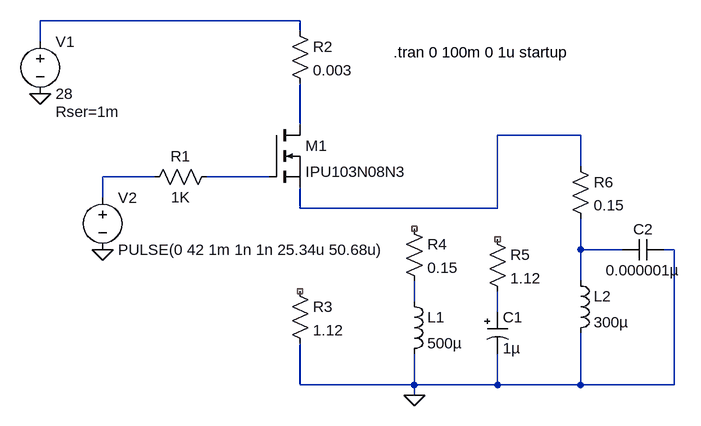
[diagram p0: schematic CurrentLim.asc]
CurrentLim.asc, the LTspice schematic file:
Version 4
SHEET 1 880 680
WIRE 192 -32 -208 -32
WIRE 192 -16 192 -32
WIRE -208 0 -208 -32
WIRE 192 128 192 64
WIRE 624 144 496 144
WIRE 624 192 624 144
WIRE -32 208 -112 208
WIRE 144 208 48 208
WIRE -112 240 -112 208
WIRE 192 256 192 224
WIRE 496 256 496 144
WIRE 496 256 192 256
WIRE 624 320 624 272
WIRE 688 320 624 320
WIRE 768 320 752 320
WIRE 624 368 624 320
WIRE 368 400 368 368
WIRE 496 416 496 384
WIRE 192 528 192 464
WIRE 368 528 368 480
WIRE 368 528 192 528
WIRE 496 528 496 480
WIRE 496 528 368 528
WIRE 624 528 624 448
WIRE 624 528 496 528
WIRE 768 528 768 320
WIRE 768 528 624 528
WIRE 368 544 368 528
FLAG -208 80 0
FLAG -112 320 0
FLAG 368 544 0
SYMBOL nmos 144 128 R0
SYMATTR InstName M1
SYMATTR Value IPU103N08N3
SYMBOL res -48 224 R270
WINDOW 0 32 56 VTop 2
WINDOW 3 0 56 VBottom 2
SYMATTR InstName R1
SYMATTR Value 1K
SYMATTR SpiceLine tol=1 pwr=0.1
SYMBOL res 176 -32 R0
SYMATTR InstName R2
SYMATTR Value 0.003
SYMATTR SpiceLine tol=1 pwr=2
SYMBOL res 176 368 R0
SYMATTR InstName R3
SYMATTR Value 1.12
SYMATTR SpiceLine tol=1 pwr=100
SYMBOL ind 352 384 R0
SYMATTR InstName L1
SYMATTR Value 500µ
SYMATTR SpiceLine Ipk=0.54 Rser=0.3225 Rpar=9420 Cpar=0
SYMBOL res 352 272 R0
SYMATTR InstName R4
SYMATTR Value 0.15
SYMATTR SpiceLine tol=1 pwr=100
SYMBOL polcap 480 416 R0
WINDOW 3 24 56 Left 2
SYMATTR InstName C1
SYMATTR Value 1µ
SYMATTR Description Capacitor
SYMATTR Type cap
SYMATTR SpiceLine V=16 Irms=0 Rser=11 Lser=0 mfg="AVX" pn="TAJA105K016" type="Tantalum"
SYMBOL res 480 288 R0
SYMATTR InstName R5
SYMATTR Value 1.12
SYMATTR SpiceLine tol=1 pwr=100
SYMBOL res 608 176 R0
SYMATTR InstName R6
SYMATTR Value 0.15
SYMATTR SpiceLine tol=1 pwr=100
SYMBOL cap 752 304 R90
WINDOW 0 0 32 VBottom 2
WINDOW 3 32 32 VTop 2
SYMATTR InstName C2
SYMATTR Value 0.000001µ
SYMATTR SpiceLine V=10 Irms=40.7m Rser=3.62516 Lser=0
SYMBOL voltage -208 -16 R0
WINDOW 123 0 0 Left 2
WINDOW 39 24 124 Left 2
SYMATTR InstName V1
SYMATTR Value 28
SYMATTR SpiceLine Rser=1m
SYMBOL voltage -112 224 R0
WINDOW 123 0 0 Left 2
WINDOW 39 0 0 Left 2
SYMATTR InstName V2
SYMATTR Value PULSE(0 42 1m 1n 1n 25.34u 50.68u)
SYMBOL ind 608 352 R0
SYMATTR InstName L2
SYMATTR Value 300µ
SYMATTR SpiceLine Ipk=0.54 Rser=0.3225 Rpar=9420 Cpar=0
TEXT 336 16 Left 2 !.tran 0 100m 0 1u startup

The netlist it stands for:
* CurrentLim.asc
M1 N002 N005 N003 N003 IPU103N08N3
R1 N004 N005 1K tol=1 pwr=0.1
R2 N001 N002 0.003 tol=1 pwr=2
R3 NC_01 0 1.12 tol=1 pwr=100
L1 N007 0 500µ Ipk=0.54 Rser=0.3225 Rpar=9420 Cpar=0
R4 NC_02 N007 0.15 tol=1 pwr=100
C1 N008 0 1µ V=16 Irms=0 Rser=11 Lser=0 mfg="AVX" pn="TAJA105K016" type="Tantalum"
R5 NC_03 N008 1.12 tol=1 pwr=100
R6 N003 N006 0.15 tol=1 pwr=100
C2 0 N006 0.000001µ V=10 Irms=40.7m Rser=3.62516 Lser=0
V1 N001 0 28 Rser=1m
V2 N004 0 PULSE(0 42 1m 1n 1n 25.34u 50.68u)
L2 N006 0 300µ Ipk=0.54 Rser=0.3225 Rpar=9420 Cpar=0
.model NMOS NMOS
.model PMOS PMOS
.lib standard.mos
.tran 0 100m 0 1u startup
.backanno
.end